# EAGLE schematic underground_cable_fault_finder (EAGLE 6.1)
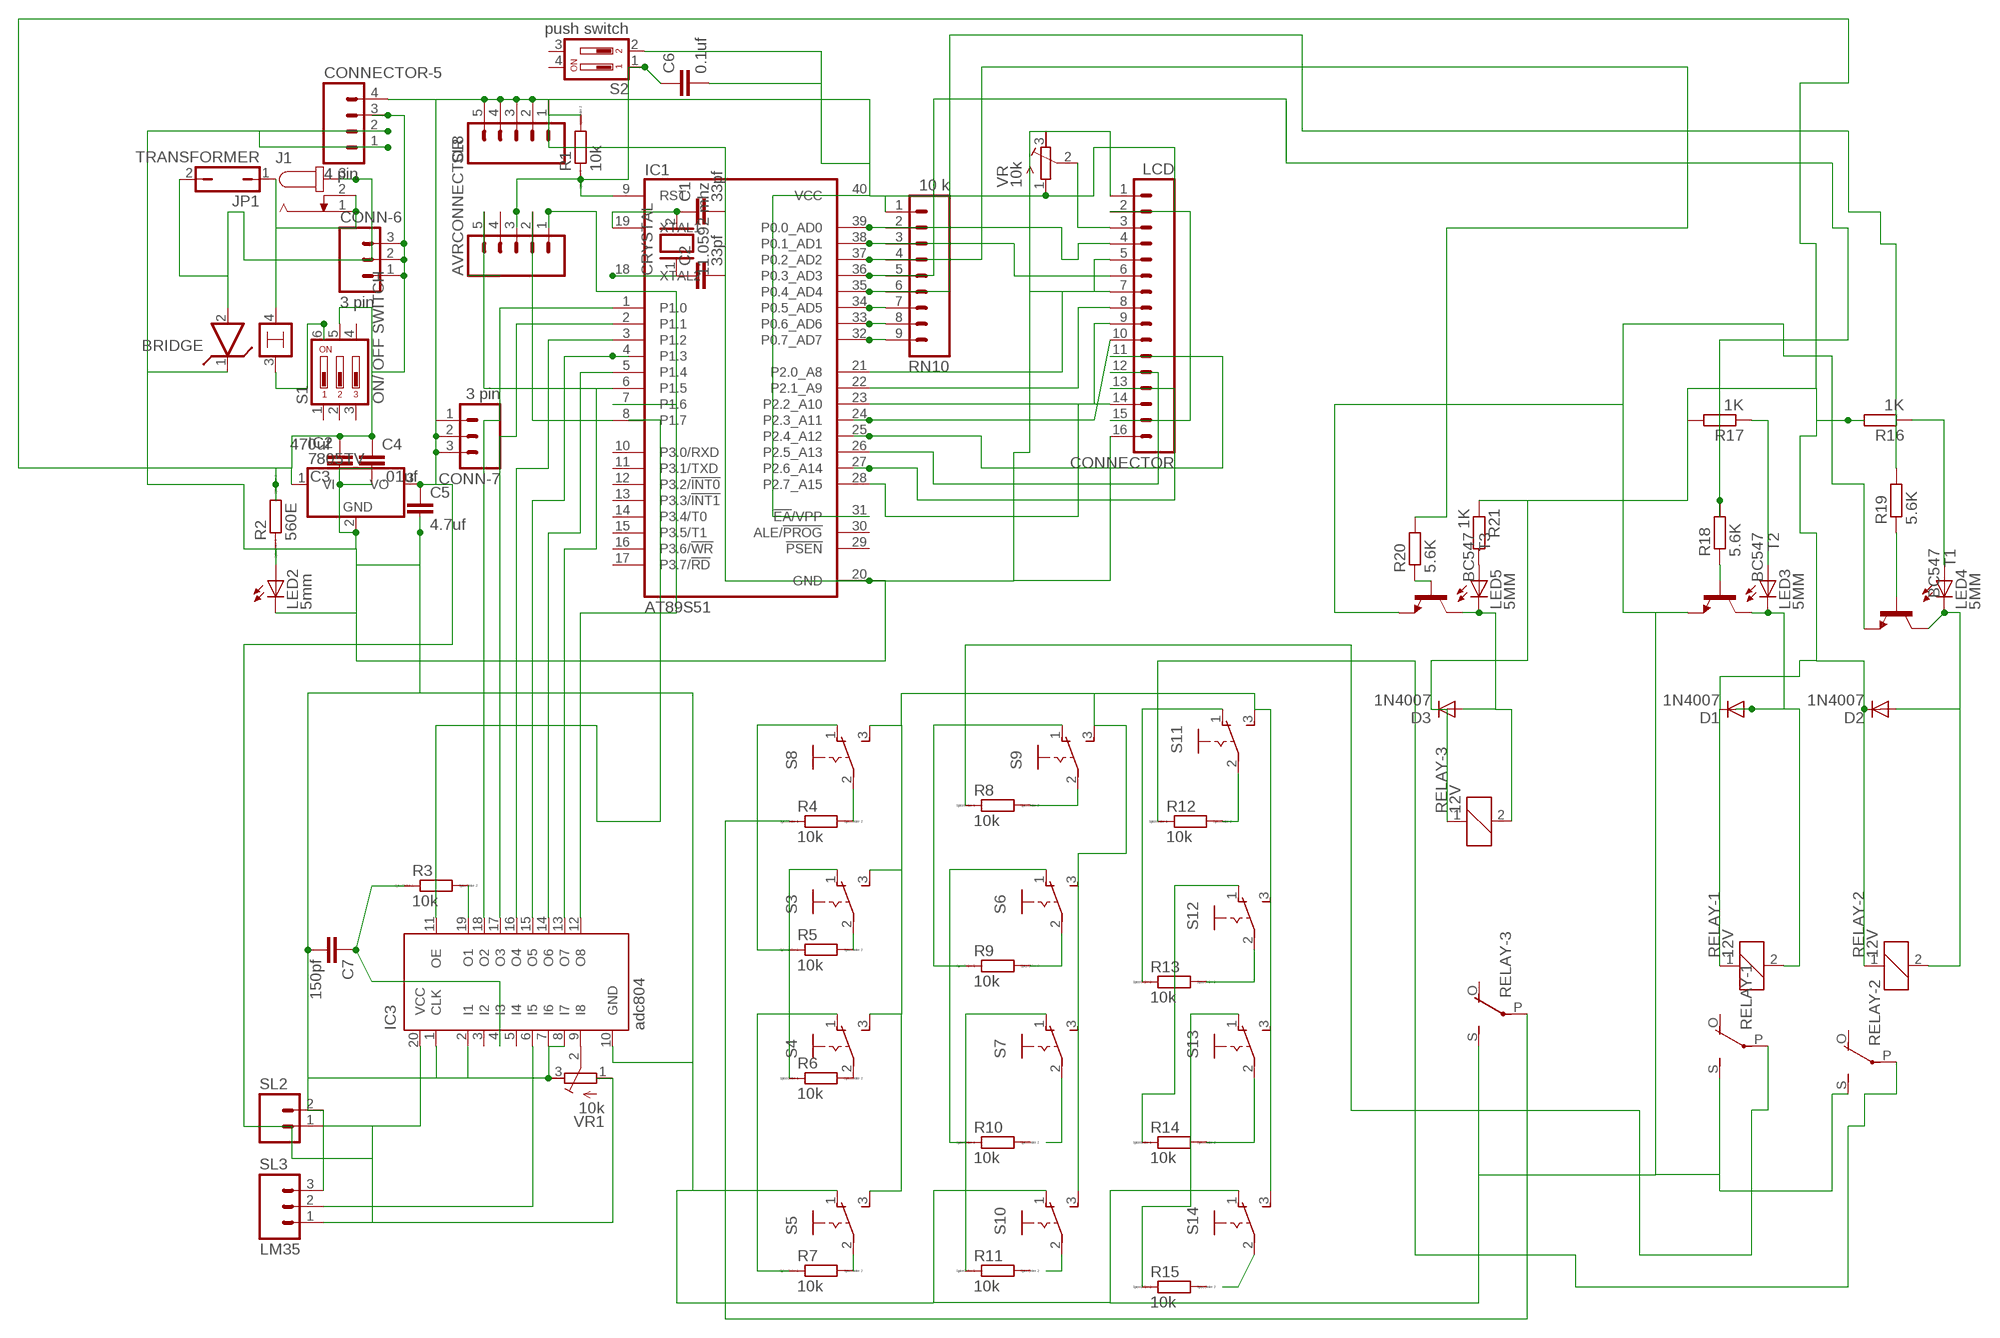
[diagram p0: schematic, sheet 1]

## Parts
AVRCONNECTOR  M05  [05P]
BRIDGE  LM399H  [TO39/4]
C1  33pf  C-EU025-024X044  [C025-024X044]
C2  33pf  C-EU025-024X044  [C025-024X044]
C3  470uf  C5/7.2  [C5B7.2]
C4  .01uf  C2,5-3  [C2.5-3]
C5  4.7uf  C2,5-3  [C2.5-3]
C6  0.1uf  C2.5/6  [C2.5-6]
C7  150pf  C2,5-3  [C2.5-3]
CONN-6  3 pin  M03  [03P]
CONN-7  3 pin  M03  [03P]
CONNECTOR  LCD  M16  [16P]
CONNECTOR-5  4 pin  M04  [04P]
CRYSTAL  11.0592 mhz  XTAL/S  [QS]
D1  1N4007  1N4004  [DO41-10]
D2  1N4007  1N4004  [DO41-10]
D3  1N4007  1N4004  [DO41-10]
IC1  AT89S51  AT89C51-12PC  [DIL40]
IC2  7805TV  [TO220V]
IC3  adc804  ATF16V8BP3  [DIL20]
J1  JACK-PLUG0  [SPC4077]
JP1  TRANSFORMER  JP1Q  [JP1]
LED2  5mm  LED5MM  [LED5MM]
LED3  5MM  LED5MM  [LED5MM]
LED4  5MM  LED5MM  [LED5MM]
LED5  5MM  LED5MM  [LED5MM]
R1  10k  R0204/7  [0204/7]
R2  560E  R0204/7  [0204/7]
R3  10k  R0204/7  [0204/7]
R4  10k  R0204/7  [0204/7]
R5  10k  R0204/7  [0204/7]
R6  10k  R0204/7  [0204/7]
R7  10k  R0204/7  [0204/7]
R8  10k  R0204/7  [0204/7]
R9  10k  R0204/7  [0204/7]
R10  10k  R0204/7  [0204/7]
R11  10k  R0204/7  [0204/7]
R12  10k  R0204/7  [0204/7]
R13  10k  R0204/7  [0204/7]
R14  10k  R0204/7  [0204/7]
R15  10k  R0204/7  [0204/7]
R16  1K  R-EU_0204/7  [0204/7]
R17  1K  R-EU_0204/7  [0204/7]
R18  5.6K  R-EU_0204/7  [0204/7]
R19  5.6K  R-EU_0204/7  [0204/7]
R20  5.6K  R-EU_0204/7  [0204/7]
R21  1K  R-EU_0204/7  [0204/7]
RELAY-1  12V  G5L  [G5LE]
RELAY-2  12V  G5L  [G5LE]
RELAY-3  12V  G5L  [G5LE]
RN10  10 k  M09  [09P]
S1  ON/ OFF SWITCH  DA03  [DA-03]
S2  push switch  DP02  [DP-02]
S3  255SB  [255SB]
S4  255SB  [255SB]
S5  255SB  [255SB]
S6  255SB  [255SB]
S7  255SB  [255SB]
S8  255SB  [255SB]
S9  255SB  [255SB]
S10  255SB  [255SB]
S11  255SB  [255SB]
S12  255SB  [255SB]
S13  255SB  [255SB]
S14  255SB  [255SB]
SL2  M02  [02P]
SL3  LM35  M03  [03P]
SL8  M05  [05P]
T1  BC547  [TO92]
T2  BC547  [TO92]
T3  BC547  [TO92]
VR  10k  R-TRIMM64P  [RTRIM64P]
VR1  10k  R-TRIMM64P  [RTRIM64P]

## Nets
N$1: C2.1 CRYSTAL.1 IC1.18(XTAL2)
N$2: C1.1 CRYSTAL.2 IC1.19(XTAL1)
N$3: BRIDGE.1 C1.2 C2.2 C3.1 C4.2 C5.2 C7.2 CONNECTOR-5.1 CONNECTOR-5.2 CONNECTOR.1 CONNECTOR.5 CONNECTOR.16 IC1.20(GND) IC2.2(GND) IC3.1(CLK) IC3.2(I1) IC3.7(I6) IC3.8(I7) IC3.10(GND) LED2.K(C) R1.2 RELAY-1.S(2:S) RELAY-2.S(2:S) RELAY-3.S(2:S) S5.1(O) S10.1(O) S14.1(O) SL2.2 SL3.3 SL8.1 T1.1(E) T2.1(E) T3.1(E) VR1.3(A) VR.3(A)
N$4: C3.2 C4.1 CONN-6.1 CONN-6.2 CONN-6.3 CONNECTOR-5.3 D1.C D2.C D3.C IC2.1(VI) R2.2 R16.2 R17.2 R21.1 RELAY-1.1 RELAY-2.1 RELAY-3.1 S1.5
N$5: BRIDGE.2 J1.3 JP1.2
N$6: IC1.1(P1.0) IC3.18(O2)
N$7: IC1.2(P1.1) IC3.17(O3)
N$8: IC1.3(P1.2) IC3.16(O4)
N$9: IC1.4(P1.3) IC3.15(O5)
N$10: IC1.5(P1.4) IC3.14(O6)
N$11: AVRCONNECTOR.5 IC1.6(P1.5) IC3.13(O7)
N$12: AVRCONNECTOR.1 IC1.7(P1.6) IC3.12(O8)
N$13: IC3.11(OE)
N$14: AVRCONNECTOR.3 C6.1 IC1.9(RST) R1.1 S2.1
N$15: C5.1 C6.2 CONN-7.1 CONN-7.2 CONN-7.3 CONNECTOR-5.4 CONNECTOR.2 CONNECTOR.15 IC1.31(!EA!/VPP) IC1.40(VCC) IC2.3(VO) IC3.20(VCC) RN10.1 S2.2 SL2.1 SL3.1 SL8.2 SL8.3 SL8.4 SL8.5 VR1.1(E) VR.1(E)
N$16: BRIDGE.4 J1.1 J1.2 JP1.1
N$17: IC3.19(O1) R3.2
N$18: C7.1 IC3.4(I3) R3.1
N$19: IC3.6(I5) SL3.2
N$20: S3.3(S) S4.3(S) S5.3(S) S6.3(S) S7.3(S) S8.3(S) S9.3(S) S10.3(S) S11.3(S) S12.3(S) S13.3(S) S14.3(S)
N$21: R4.2 S8.2(P)
N$22: R5.2 S3.2(P)
N$23: IC3.9(I8) VR1.2(S)
N$24: IC1.37(P0.2_AD2) RN10.4
N$25: IC1.36(P0.3_AD3) R18.2 RN10.5
N$27: IC1.34(P0.5_AD5) RN10.7
N$28: IC1.33(P0.6_AD6) RN10.8
N$29: IC1.32(P0.7_AD7) RN10.9
N$30: CONNECTOR.7 IC1.21(P2.0_A8)
N$31: CONNECTOR.8 IC1.22(P2.1_A9)
N$32: CONNECTOR.9 IC1.23(P2.2_A10)
N$33: R5.1 S8.1(O)
N$34: R6.2 S4.2(P)
N$35: CONNECTOR.12 IC1.26(P2.5_A13)
N$36: R6.1 S3.1(O)
N$37: R7.2 S5.2(P)
N$38: CONNECTOR.3 VR.2(S)
N$40: R9.1 S9.1(O)
N$41: R8.2 S9.2(P)
N$42: R9.2 S6.2(P)
N$43: LED2.A R2.1
N$44: R10.1 S6.1(O)
N$45: AVRCONNECTOR.2 IC1.8(P1.7)
N$47: BRIDGE.3 S1.6
N$48: CONNECTOR.6 IC1.38(P0.1_AD1) RN10.3
N$49: S7.2(P)
N$50: R11.1 S7.1(O)
N$51: CONNECTOR.10 IC1.24(P2.3_A11)
N$52: CONNECTOR.11 IC1.25(P2.4_A12)
N$53: S10.2(P)
N$54: CONNECTOR.13 IC1.27(P2.6_A14)
N$55: CONNECTOR.14 IC1.28(P2.7_A15)
N$57: R12.2 S11.2(P)
N$58: CONNECTOR.4 IC1.39(P0.0_AD0) RN10.2
N$59: R13.2 S12.2(P)
N$60: R14.2 S13.2(P)
N$61: S14.2(P)
N$62: R13.1 S11.1(O)
N$63: R14.1 S12.1(O)
N$64: R15.1 S13.1(O)
N$65: D1.A LED3.K(C) RELAY-1.2 T2.3(C)
N$67: R19.1 T1.2(B)
N$68: R18.1 T2.2(B)
N$69: LED3.A R17.1
N$70: LED4.A R16.1
N$72: R8.1 RELAY-1.P(2:P)
N$73: R12.1 RELAY-2.P(2:P)
N$74: R20.2
N$75: D2.A LED4.K(C) RELAY-2.2 T1.3(C)
N$77: D3.A LED5.K(C) RELAY-3.2 T3.3(C)
N$78: R20.1 T3.2(B)
N$79: LED5.A R21.2
N$80: R4.1 RELAY-3.P(2:P)
N$83: IC1.35(P0.4_AD4) R19.2 RN10.6
N$84: R7.1 S4.1(O)
Unconnected: AVRCONNECTOR.4 IC1.10(P3.0/RXD) IC1.11(P3.1/TXD) IC1.12(P3.2/!INT0) IC1.13(P3.3/!INT1) IC1.14(P3.4/T0) IC1.15(P3.5/T1) IC1.16(P3.6/!WR) IC1.17(P3.7/!RD) IC1.29(!PSEN) IC1.30(ALE/!PROG) IC3.3(I2) IC3.5(I4) R10.2 R11.2 R15.2 RELAY-1.O(2:O) RELAY-2.O(2:O) RELAY-3.O(2:O) S1.1 S1.2 S1.3 S1.4 S2.3 S2.4

## Library data of the parts
AVRCONNECTOR SL8 = con-amp-quick:M05: AMP QUICK CONNECTOR; OC_FARNELL: unknown; OC_NEWARK: unknown
BRIDGE = linear:LM399H: Precision Z DIODE
C1 C2 = rcl:C-EU: CAPACITOR, European symbol
C3-C7 = capacitor-wima:C: CAPACITOR naming: grid - package width
CONN-6 CONN-7 SL3 = con-amp-quick:M03: AMP QUICK CONNECTOR; OC_FARNELL: unknown; OC_NEWARK: unknown
CONNECTOR = con-amp-quick:M16: AMP QUICK CONNECTOR; OC_FARNELL: unknown; OC_NEWARK: unknown
CONNECTOR-5 = con-amp-quick:M04: AMP QUICK CONNECTOR; OC_FARNELL: unknown; OC_NEWARK: unknown
CRYSTAL = special:XTAL/S: CRYSTAL
D1-D3 = diode:1N4004: DIODE general purpose rectifier, 1 A
IC1 = atmel:AT89C51-*: 8-bit Microcontroller with 4K Bytes Flash Not Recommended for New Designs. Use AT89S51. Source: http://www.atmel.com/dyn/resources/prod_documents/doc0265.; OC_FARNELL: unknown; OC_NEWARK: unknown
IC2 = linear:78*: Positive VOLTAGE REGULATOR Source: http://cache.national.com/ds/LM/LM78L05.pdf http://www.fairchildsemi.com/ds/LM/LM7805.pdf
IC3 = atmel:ATF16V8B: High perfomance CMOS (electrically erasable) programmable logic device (PLD) ABLE-Atmel-ABEL - P18V8R, P16V8C, P16V8AS, P17V8 COPL Atmel-WinCUPL - G16V8MS, G16V8MA, G16V8AS, G16V8 LOG/IC - GAL16V8_R, GAL16V8_G7, GAL16V8_C), GAL16V8 Tango-PLD - G16V8R, G16V8C, G16V8AS, G16V8 Source: http://www.atmel.com/dyn/resources/prod_documents/DOC0364.PDF; MPN: ATF16V8CZ-15PU; OC_FARNELL: 1551768; OC_NEWARK: 94M6254
J1 = con-jack:JACK-PLUG: DC POWER JACK Power Jack, DC, Right Angle, Through Hole, Rated 5A at 16VDC, PC Terminals Distributor: Farnell (www.Farnell.de) Drawing: 84N1161.pdf / 84N1162.pdf Manufacturer: SPC Technology (www.spctechnology.com) Type: SPC4077 / SPC 4078; OC_FARNELL: unknown; OC_NEWARK: unknown
JP1 = jumper:JP1Q: JUMPER
LED2-LED5 = led:LED: LED OSRAM: - CHIPLED LG R971, LG N971, LY N971, LG Q971, LY Q971, LO R971, LY R971 LH N974, LH R974 LS Q976, LO Q976, LY Q976 LO Q996 - Hyper CHIPLED LW Q18S LB Q993, LB Q99A, LB R99A - SideLED LS A670, LO A670, LY A670, LG A670, LP A670 LB A673, LV A673, LT A673, LW A673 LH A674 LY A675 LS A676, LA A676, LO A676, LY A676, LW A676 LS A679, LY A679, LG A679 - Hyper Micro SIDELED® LS Y876, LA Y876, LO Y876, LY Y876 LT Y87S - SmartLED LW L88C, LW L88S LB L89C, LB L89S, LG L890 LS L89K, LO L89K, LY L89K LS L896, LA L896, LO L896, LY L896 - TOPLED LS T670, LO T670, LY T670, LG T670, LP T670 LSG T670, LSP T670, LSY T670, LOP T670, LYG T670 LG T671, LOG T671, LSG T671 LB T673, LV T673, LT T673, LW T673 LH T674 LS T676, LA T676, LO T676, LY T676, LB T676, LH T676, LSB T676, LW T676 LB T67C, LV T67C, LT T67C, LS T67K, LO T67K, LY T67K, LW E67C LS E67B, LA E67B, LO E67B, LY E67B, LB E67C, LV E67C, LT E67C LW T67C LS T679, LY T679, LG T679 LS T770, LO T770, LY T770, LG T770, LP T770 LB T773, LV T773, LT T773, LW T773 LH T774 LS E675, LA E675, LY E675, LS T675 LS T776, LA T776, LO T776, LY T776, LB T776 LHGB T686 LT T68C, LB T68C - Hyper Mini TOPLED® LB M676 - Mini TOPLED Santana® LG M470 LS M47K, LO M47K, LY M47K Source: http://www.osram.convergy.de LUXEON: - LUMILED® LXK2-PW12-R00, LXK2-PW12-S00, LXK2-PW14-U00, LXK2-PW14-V00 LXK2-PM12-R00, LXK2-PM12-S00, LXK2-PM14-U00 LXK2-PE12-Q00, LXK2-PE12-R00, LXK2-PE12-S00, LXK2-PE14-T00, LXK2-PE14-U00 LXK2-PB12-K00, LXK2-PB12-L00, LXK2-PB12-M00, LXK2-PB14-N00, LXK2-PB14-P00, LXK2-PB14-Q00 LXK2-PR12-L00, LXK2-PR12-M00, LXK2-PR14-Q00, LXK2-PR14-R00 LXK2-PD12-Q00, LXK2-PD12-R00, LXK2-PD12-S00 LXK2-PH12-R00, LXK2-PH12-S00 LXK2-PL12-P00, LXK2-PL12-Q00, LXK2-PL12-R00 Source: www.luxeon.com KINGBRIGHT: KA-3528ASYC Source: www.kingbright.com
R1-R15 = eagle-ltspice:R: RESISTOR, European symbol; SPICEMODEL: NONE; SPICEPREFIX: R
R16-R21 = rcl:R-EU_: RESISTOR, European symbol
RELAY-1-RELAY-3 = relay:G5L: RELAY 1 x switch, 10 A/120 V AC, 8 A/30 V ADC, Omron; OC_FARNELL: unknown; OC_NEWARK: unknown
RN10 = con-amp-quick:M09: AMP QUICK CONNECTOR; OC_FARNELL: unknown; OC_NEWARK: unknown
S1 = switch-dil:DA03: DIL/CODE SWITCH; MPN: MCDA03; OC_FARNELL: 1521999; OC_NEWARK: 74M2972
S2 = switch-dil:DP02: DIL/CODE SWITCH; MPN: MCDP02; OC_FARNELL: 1255233; OC_NEWARK: 26M1095
S3-S14 = switch:255SB: SLIDING SWITCH Distributor Buerklin, 11G810
SL2 = con-amp-quick:M02: AMP QUICK CONNECTOR; OC_FARNELL: unknown; OC_NEWARK: unknown
T1-T3 = transistor:BC547: NPN TRANSISTOR
VR VR1 = resistor:R-TRIMM: Trimm resistor